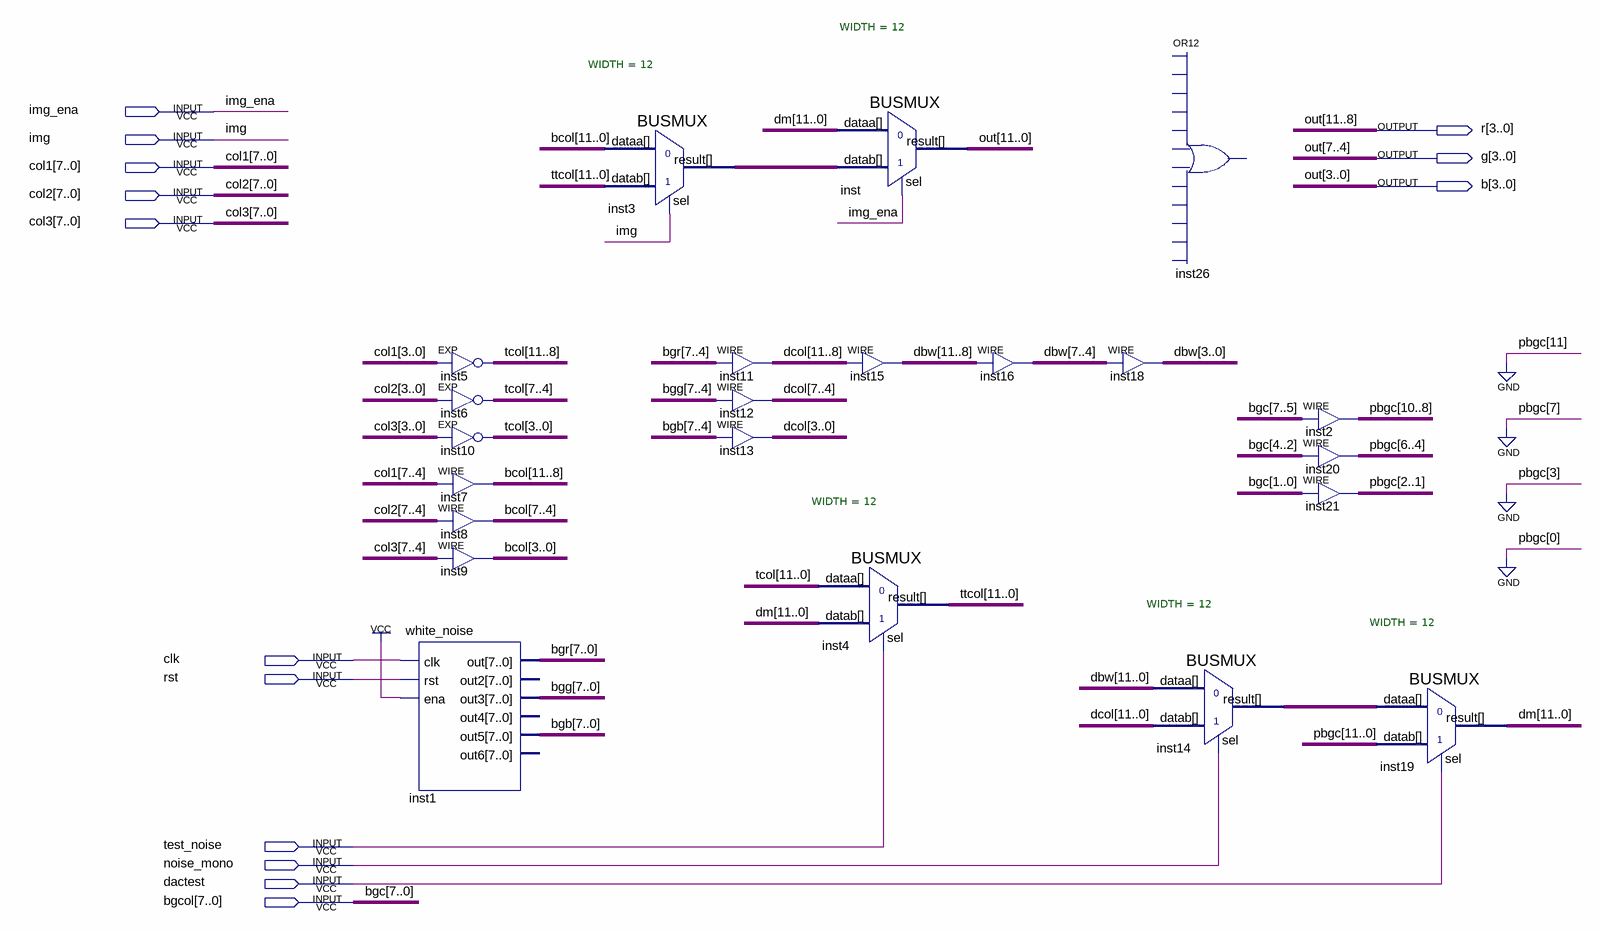
[diagram p0: schematic sheet]
// Quartus schematic color_sel.bdf as structural Verilog: 22 symbols, 14 pins
module color_sel (
  input  img_ena,
  input  img,
  input  [7:0] col1,
  input  [7:0] col2,
  input  [7:0] col3,
  input  clk,
  input  rst,
  input  test_noise,
  input  noise_mono,
  input  dactest,
  input  [7:0] bgcol,
  output [3:0] r,
  output [3:0] g,
  output [3:0] b
);

  wire [7:0] bgb, bgg, bgr;
  wire [10:1] pbgc;
  wire [11:0] bcol, dbw, dcol, dm, inst3_result, inst14_result, tcol, ttcol;

  EXP inst5[3:0] (.IN(col1[3:0]), .OUT(tcol[11:8]));
  EXP inst6[3:0] (.IN(col2[3:0]), .OUT(tcol[7:4]));
  EXP inst10[3:0] (.IN(col3[3:0]), .OUT(tcol[3:0]));
  assign bcol[11:8] = col1[7:4];  // WIRE inst7
  assign bcol[7:4] = col2[7:4];  // WIRE inst8
  assign bcol[3:0] = col3[7:4];  // WIRE inst9
  white_noise inst1 (.clk(clk), .rst(rst), .ena(1'b1), .out(bgr), .out3(bgg), .out5(bgb));  // open: out2, out4, out6
  BUSMUX #(.WIDTH(12)) inst3 (.datab(ttcol), .sel(img), .dataa(bcol), .result(inst3_result));
  assign dcol[11:8] = bgr[7:4];  // WIRE inst11
  assign dcol[7:4] = bgg[7:4];  // WIRE inst12
  assign dcol[3:0] = bgb[7:4];  // WIRE inst13
  BUSMUX #(.WIDTH(12)) inst (.datab(inst3_result), .sel(img_ena), .dataa(dm), .result({r, g, b}));
  BUSMUX #(.WIDTH(12)) inst4 (.datab(dm), .sel(test_noise), .dataa(tcol), .result(ttcol));
  assign dbw[11:8] = dcol[11:8];  // WIRE inst15
  assign dbw[7:4] = dbw[11:8];  // WIRE inst16
  assign dbw[3:0] = dbw[7:4];  // WIRE inst18
  // OR12 inst26 is placed but not wired
  BUSMUX #(.WIDTH(12)) inst14 (.datab(dcol), .sel(noise_mono), .dataa(dbw), .result(inst14_result));
  assign pbgc[10:8] = bgcol[7:5];  // WIRE inst2
  assign pbgc[6:4] = bgcol[4:2];  // WIRE inst20
  assign pbgc[2:1] = bgcol[1:0];  // WIRE inst21
  BUSMUX #(.WIDTH(12)) inst19 (
    .datab({1'b0, pbgc[10:8], 1'b0, pbgc[6:4], 1'b0, pbgc[2:1], 1'b0}), .sel(dactest), .dataa(inst14_result),
    .result(dm));

  // Other names for the same wires on the sheet: bgc[7:0] = bgcol; out[11:0] = {r, g, b}
endmodule
